# Altium schematic sheet floorctrl.SchDoc
size A
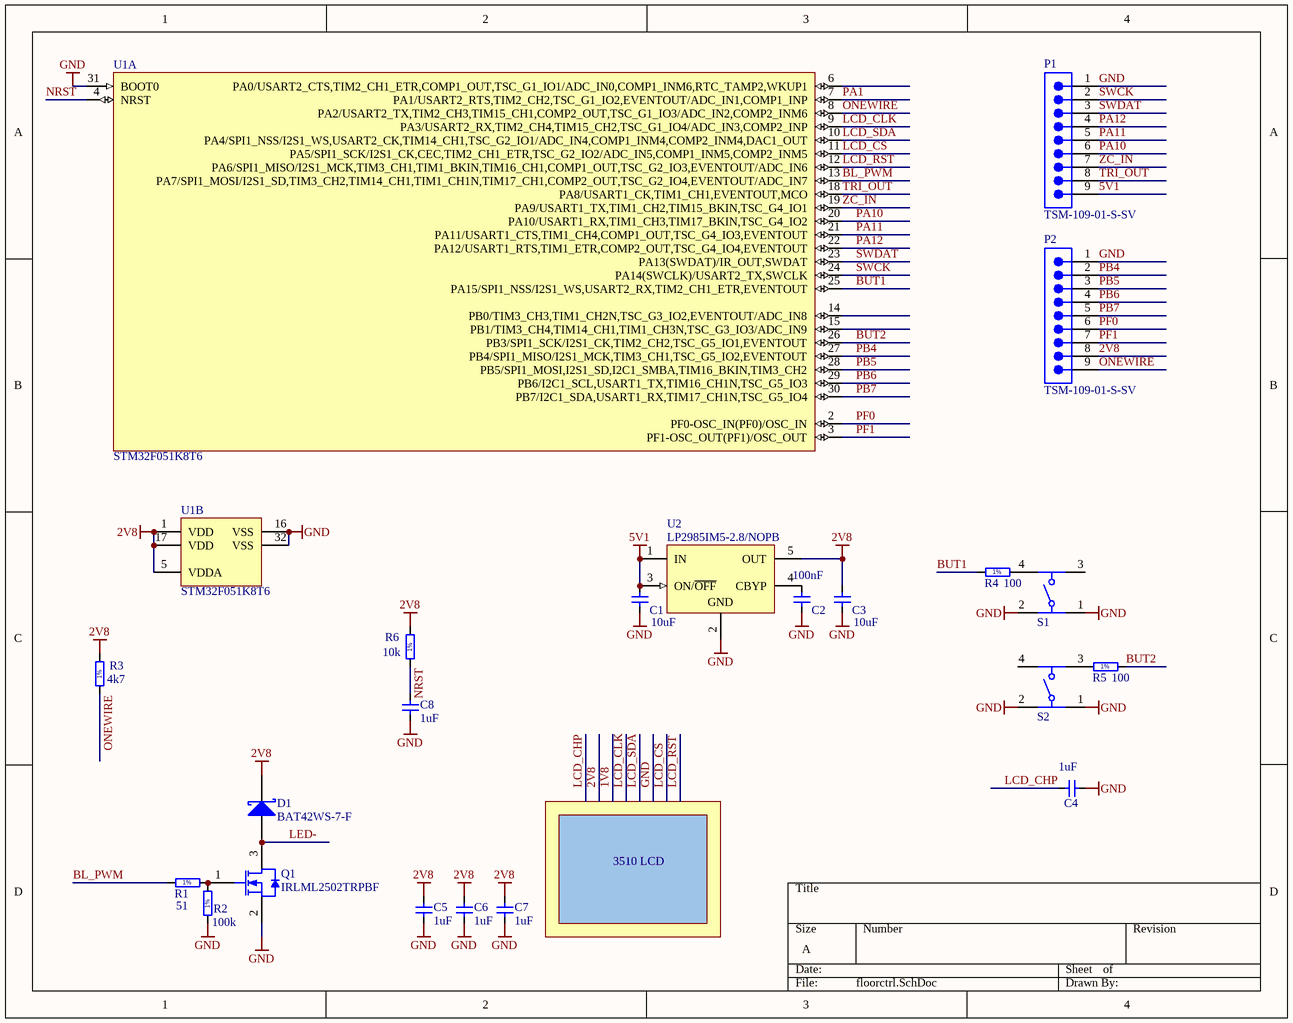
[diagram p0: floorctrl.SchDoc]

## Parts
C1  10uF  [CAP0805R]
C2  100nF  [CAP0805R]
C3  10uF  [CAP0805R]
C4  1uF  [CAP0805R]
C5  1uF  [CAP0805R]
C6  1uF  [CAP0805R]
C7  1uF  [CAP0805R]
C8  1uF  [CAP0805R]
D1  BAT42WS-7-F  [DIOD-SOD323-2_V]
P1  TSM-109-01-S-SV  [SMTC-TSM-109-01-X-SV]
P2  TSM-109-01-S-SV  [SMTC-TSM-109-01-X-SV]
Q1  IRLML2502TRPBF  [INTR-SOT-23-3_V]
R1  51  [RES0805R]
R2  100k  [RES0805R]
R3  4k7  [RES0805R]
R4  100  [RES0805R]
R5  100  [RES0805R]
R6  10k  [RES0805R]
S1  430476073716  [4304x60737x6_12x12x7.3]  (value not drawn)
S2  430476073716  [4304x60737x6_12x12x7.3]  (value not drawn)
U1  STM32F051K8T6  [STM-LQFP32_L]  (parts A,B of 2)
U2  LP2985IM5-2.8/NOPB  [DBV0005A_L]

## Nets
2V8: C3.2 C5.2 C6.2 C7.2 D1.2(K) P2.8 R3.2 R6.2 U1.1(VDD) U1.5(VDDA) U1.17(VDD) U2.5(OUT)
5V1: C1.2 P1.9 U2.1(IN) U2.3(ON/~{OFF})
GND: C1.1 C2.1 C3.1 C4.2 C5.1 C6.1 C7.1 C8.1 P1.1 P2.1 Q1.2(S) R2.1 S1.1 S1.2 S2.1 S2.2 U1.16(VSS) U1.31(BOOT0) U1.32(VSS) U2.2(GND)
BL_PWM: R1.1 U1.13(PA7/SPI1_MOSI/I2S1_SD,TIM3_CH2,TIM14_CH1,TIM1_CH1N,TIM17_CH1,COMP2_OUT,TSC_G2_IO4,EVENTOUT/ADC_IN7)
BUT1: R4.1 U1.25(PA15/SPI1_NSS/I2S1_WS,USART2_RX,TIM2_CH1_ETR,EVENTOUT)
BUT2: R5.2 U1.26(PB3/SPI1_SCK/I2S1_CK,TIM2_CH2,TSC_G5_IO1,EVENTOUT)
LCD_CHP: C4.1
LCD_CLK: U1.9(PA3/USART2_RX,TIM2_CH4,TIM15_CH2,TSC_G1_IO4/ADC_IN3,COMP2_INP)
LCD_CS: U1.11(PA5/SPI1_SCK/I2S1_CK,CEC,TIM2_CH1_ETR,TSC_G2_IO2/ADC_IN5,COMP1_INM5,COMP2_INM5)
LCD_RST: U1.12(PA6/SPI1_MISO/I2S1_MCK,TIM3_CH1,TIM1_BKIN,TIM16_CH1,COMP1_OUT,TSC_G2_IO3,EVENTOUT/ADC_IN6)
LCD_SDA: U1.10(PA4/SPI1_NSS/I2S1_WS,USART2_CK,TIM14_CH1,TSC_G2_IO1/ADC_IN4,COMP1_INM4,COMP2_INM4,DAC1_OUT)
LED-: D1.1(A) Q1.3(D)
NRST: C8.2 R6.1 U1.4(NRST)
ONEWIRE: P2.9 R3.1 U1.8(PA2/USART2_TX,TIM2_CH3,TIM15_CH1,COMP2_OUT,TSC_G1_IO3/ADC_IN2,COMP2_INM6)
PA1: U1.7(PA1/USART2_RTS,TIM2_CH2,TSC_G1_IO2,EVENTOUT/ADC_IN1,COMP1_INP)
PA10: P1.6 U1.20(PA10/USART1_RX,TIM1_CH3,TIM17_BKIN,TSC_G4_IO2)
PA11: P1.5 U1.21(PA11/USART1_CTS,TIM1_CH4,COMP1_OUT,TSC_G4_IO3,EVENTOUT)
PA12: P1.4 U1.22(PA12/USART1_RTS,TIM1_ETR,COMP2_OUT,TSC_G4_IO4,EVENTOUT)
PB4: P2.2 U1.27(PB4/SPI1_MISO/I2S1_MCK,TIM3_CH1,TSC_G5_IO2,EVENTOUT)
PB5: P2.3 U1.28(PB5/SPI1_MOSI,I2S1_SD,I2C1_SMBA,TIM16_BKIN,TIM3_CH2)
PB6: P2.4 U1.29(PB6/I2C1_SCL,USART1_TX,TIM16_CH1N,TSC_G5_IO3)
PB7: P2.5 U1.30(PB7/I2C1_SDA,USART1_RX,TIM17_CH1N,TSC_G5_IO4)
PF0: P2.6 U1.2(PF0-OSC_IN(PF0)/OSC_IN)
PF1: P2.7 U1.3(PF1-OSC_OUT(PF1)/OSC_OUT)
SWCK: P1.2 U1.24(PA14(SWCLK)/USART2_TX,SWCLK)
SWDAT: P1.3 U1.23(PA13(SWDAT)/IR_OUT,SWDAT)
TRI_OUT: P1.8 U1.18(PA8/USART1_CK,TIM1_CH1,EVENTOUT,MCO)
ZC_IN: P1.7 U1.19(PA9/USART1_TX,TIM1_CH2,TIM15_BKIN,TSC_G4_IO1)
NetC2_2: C2.2 U2.4(CBYP)
NetQ1_1: Q1.1(G) R1.2 R2.2
NetR4_2: R4.2 S1.4
NetR5_1: R5.1 S2.3

Not connected (* = marked no-connect by the designer): S1 3; S2 4; U1 6(PA0/USART2_CTS,TIM2_CH1_ETR,COMP1_OUT,TSC_G1_IO1/ADC_IN0,COMP1_INM6,RTC_TAMP2,WKUP1) 14(PB0/TIM3_CH3,TIM1_CH2N,TSC_G3_IO2,EVENTOUT/ADC_IN8) 15(PB1/TIM3_CH4,TIM14_CH1,TIM1_CH3N,TSC_G3_IO3/ADC_IN9)

## Notes on the sheet
- 3510 LCD
- (in symbol R0805_4K7_1%_0.125W_100PPM) 1%
- (in symbol R0805_10K_1%_0.125W_100PPM) 1%
- (in symbol R0805_51R_1%_0.125W_100PPM) 1%
- (in symbol R0805_100K_1%_0.125W_100PPM) 1%
- (in symbol R0805_100R_1%_0.125W_100PPM) 1%

## Library data of the parts
C1 C3 = CC0805_10UF_16V_10%_X5R: Part Description: SMD Multilayer Chip Ceramic Capacitor; Manufacturer: GENERIC; Manufacturer1 Part Number: C0805C106K4PAC; Voltage: 16V; TC: X5R; Tolerance: ±10%; Table: Capacitors SMD; Part Number: CC0805_10UF_16V_10%_X5R; Component Kind: Standard; Component Type: Standard; Pin Count: 2; Value: 10uF; Status: Preferred; Manufacturer Part Number: CC0805_10UF_16V_10%_X5R; Case: 0805; Mounted: Yes; Socket: No; SMD: Yes; Manufacturer1 Example: KEMET; Manufacturer1 ComponentHeight: 1.4mm; HelpURL: \\cern.ch\dfs\Applications\Altium\Datasheets\CC1206_X5R_KEMET.pdf; Author: I. Kuznetsov; CreateDate: 12/3/2007; LatestRevisionDate: 12/3/2007; Manufacturer Part Number 2: CC0805KKX5R7BB106
C2 = CC0805_100NF_50V_10%_X7R: Part Description: SMD Multilayer Chip Ceramic Capacitor; Manufacturer: GENERIC; Manufacturer1 Part Number: B37941K5104K62; Voltage: 50V; TC: X7R; Tolerance: ±10%; Table: Capacitors SMD; Part Number: CC0805_100NF_50V_10%_X7R; Component Kind: Standard; Component Type: Standard; Pin Count: 2; Value: 100nF; Status: Preferred; Manufacturer Part Number: CC0805_100NF_50V_10%_X7R; Case: 0805; Mounted: Yes; Socket: No; SMD: Yes; Manufacturer1 Example: EPCOS; Manufacturer1 ComponentHeight: 1.35mm; HelpURL: \\cern.ch\dfs\Applications\Altium\Datasheets\CC0805_X7R_EPCOS.pdf; Author: I. Kuznetsov; CreateDate: 12/3/2007; LatestRevisionDate: 12/3/2007; Manufacturer Part Number 2: CC0805KPX7R9BB104
C4-C8 = CC0805_1UF_16V_10%_X7R: Part Description: SMD Multilayer Chip Ceramic Capacitor; Manufacturer: GENERIC; Manufacturer1 Part Number: B37941K9105K062; Voltage: 16V; TC: X7R; Tolerance: ±10%; Table: Capacitors SMD; Part Number: CC0805_1UF_16V_10%_X7R; Component Kind: Standard; Component Type: Standard; Pin Count: 2; Value: 1uF; Status: Preferred; Manufacturer Part Number: CC0805_1UF_16V_10%_X7R; Case: 0805; Mounted: Yes; Socket: No; SMD: Yes; Manufacturer1 Example: EPCOS; Manufacturer1 ComponentHeight: 1.3mm; HelpURL: \\cern.ch\dfs\Applications\Altium\Datasheets\CC0805_X7R_EPCOS_HC.pdf; Author: I. Kuznetsov; CreateDate: 12/3/2007; LatestRevisionDate: 12/3/2007; Manufacturer Part Number 2: CC0805KFX7R7BB105
D1 = CMP-2000-05925-1: Schottky Barrier Diode, 30 V, -55 to 125 degC, 2-Pin SOD323, RoHS, Tape and Reel; Manufacturer: DiodesIncorporated; Ir - Reverse Current: 0.5uAat25V; Type: SurfaceMountSchottkyBarrierDiode; If - Forward Current: 0.1A; Pd - Power Dissipation: 200mW; Vf - Forward Voltage: 1Vat0.2A; Unit Weight: 0.000173oz; Ifsm - Forward Surge Current: 4A; trr - Reverse Recovery time: 5ns; Configuration: Single; Vrrm - Repetitive Reverse Voltage: 30V; RoHS: True; Height: 1mm; Length: 1.8mm; Packaging: Reel; Package Reference: SOD323-2; Manufacturer URL: http://www.diodes.com/; Mounting Style: SMD/SMT; Datasheet URL: http://www.diodes.com/_files/datasheets/ds30100.pdf; Package URL: http://www.vishay.com/docs/71192/71192.pdf; Maximum Operating Temperature: +125C; Brand: DiodesIncorporated; Series: BAT42; Technology: Si; Package / Case: SOD-323; Width: 1.4mm; Package Description: 2-Pin Surface Mount Device, Body 1.7 x 1.3 mm; Termination Style: SMD/SMT; Minimum Operating Temperature: -55C; Datasheet Version: Rev. 14-2, 06/2012; Operating Temperature Range: -55Cto+125C; Product: SchottkyDiodes; Mounting Technology: SurfaceMount; Product Category: SchottkyDiodes&Rectifiers; Factory Pack Quantity: 3000
P1 P2 = CMP-1024-00278-1: 0.025" SQ Post Header, Surface Mount, Vertical, -55 to 125 degC, 2.54 mm Pitch, 9-Pin, Male, RoHS; Manufacturer: Samtec; Pitch: 2.54 mm; PackageDescription: Single Row .100 SMT Assembly; ComponentLink1URL: http://www.samtec.com; PackageVersion: BP, 8/2002; ComponentLink1Description: Manufacturer URL; DatasheetVersion: F-214; Temperature Range: -55 to 125 degC; PartNumber: TSM-109-01-S-SV; PackageReference: TSM-109-01-X-SV; RoHS: True; ComponentLink3URL: http://www.samtec.com/documents/webfiles/cpdf/TSM-1XX-XX-XXX-SV-XX-XXX-XX-MKT.pdf; Mounting Technology: Surface Mount; Orientation: Vertical; ComponentLink2URL: http://www.samtec.com/documents/webfiles/pdf/TSM.PDF; ComponentLink3Description: Package Specification; ComponentLink2Description: Datasheet
Q1 = CMP-2000-04985-1: N-Channel HEXFET(R) Power MOSFET, 20 V VDS, +/- 12 V VGS, 4.2 A, 3-Pin SOT23, RoHS, Tape and Reel; Manufacturer: International Rectifier; Drain-to-Source Voltage [Vdss]: 20V; Drain-Source On Resistance-Max: 0.045O; Qg Gate Charge: 8nC; Rated Power Dissipation: 1.25W; Package Reference: SOT-23-3; Manufacturer URL: http://internationalrectifier.com/; Package Description: 3-Pin Small Outline Transistor, Body 2.92 x 1.3 mm, Pitch 0.95 mm; Datasheet Version: Apr-14; Channel Type: N-Channel; Datasheet URL: https://datasheet.ciiva.com/6383/irlml2502pbf-6383216.pdf
R1 = R0805_51R_1%_0.125W_100PPM: Part Description: General Purpose Thick Film Chip Resistor; Manufacturer: GENERIC; Manufacturer1 Part Number: NRC10F51R0TRF; Power: 0.125W; TC: ±100ppm/°C; Tolerance: ±1%; Table: Resistors SMD; Part Number: R0805_51R_1%_0.125W_100PPM; Component Kind: Standard; Component Type: Standard; Footprint: RESC2012X60N; PackageDescription: Standard; Pin Count: 2; Value: 51; Status: Preferred; Manufacturer Part Number: R0805_51R_1%_0.125W_100PPM; Case: 0805; Mounted: Yes; Socket: No; SMD: Yes; Manufacturer1 Example: NIC COMPONENT; Manufacturer1 ComponentHeight: 0.6mm; HelpURL: \\cern.ch\dfs\Applications\Altium\Datasheets\R0805_NIC_NRC.pdf; Author: CERN DEM JLC; CreateDate: 12/3/2007; LatestRevisionDate: 3/13/2008
R2 = R0805_100K_1%_0.125W_100PPM: Part Description: General Purpose Thick Film Chip Resistor; Manufacturer: GENERIC; Manufacturer1 Part Number: NRC10F1003TRF; Power: 0.125W; TC: ±100ppm/°C; Tolerance: ±1%; Table: Resistors SMD; Part Number: R0805_100K_1%_0.125W_100PPM; Component Kind: Standard; Component Type: Standard; Footprint: RESC2012X60N; PackageDescription: Standard; Pin Count: 2; Value: 100k; Status: Preferred; Manufacturer Part Number: R0805_100K_1%_0.125W_100PPM; Case: 0805; Mounted: Yes; Socket: No; SMD: Yes; Manufacturer1 Example: NIC COMPONENT; Manufacturer1 ComponentHeight: 0.6mm; HelpURL: \\cern.ch\dfs\Applications\Altium\Datasheets\R0805_NIC_NRC.pdf; Author: CERN DEM JLC; CreateDate: 12/3/2007; LatestRevisionDate: 3/13/2008
R3 = R0805_4K7_1%_0.125W_100PPM: Part Description: General Purpose Thick Film Chip Resistor; Manufacturer: GENERIC; Manufacturer1 Part Number: NRC10F4701TRF; Power: 0.125W; TC: ±100ppm/°C; Tolerance: ±1%; Table: Resistors SMD; Part Number: R0805_4K7_1%_0.125W_100PPM; Component Kind: Standard; Component Type: Standard; Footprint: RESC2012X60N; PackageDescription: Standard; Pin Count: 2; Value: 4k7; Status: Preferred; Manufacturer Part Number: R0805_4K7_1%_0.125W_100PPM; Case: 0805; Mounted: Yes; Socket: No; SMD: Yes; Manufacturer1 Example: NIC COMPONENT; Manufacturer1 ComponentHeight: 0.6mm; HelpURL: \\cern.ch\dfs\Applications\Altium\Datasheets\R0805_NIC_NRC.pdf; Author: CERN DEM JLC; CreateDate: 12/3/2007; LatestRevisionDate: 3/13/2008
R4 R5 = R0805_100R_1%_0.125W_100PPM: Part Description: General Purpose Thick Film Chip Resistor; Manufacturer: GENERIC; Manufacturer1 Part Number: NRC10F4700TRF; Power: 0.125W; TC: ±100ppm/°C; Tolerance: ±1%; Table: Resistors SMD; Part Number: R0805_100R_1%_0.125W_100PPM; Component Kind: Standard; Component Type: Standard; Footprint: RESC2012X60N; PackageDescription: Standard; Pin Count: 2; Value: 100; Status: Preferred; Manufacturer Part Number: R0805_100R_1%_0.125W_100PPM; Case: 0805; Mounted: Yes; Socket: No; SMD: Yes; Manufacturer1 Example: NIC COMPONENT; Manufacturer1 ComponentHeight: 0.6mm; HelpURL: \\cern.ch\dfs\Applications\Altium\Datasheets\R0805_NIC_NRC.pdf; Author: CERN DEM JLC; CreateDate: 12/3/2007; LatestRevisionDate: 3/13/2008
R6 = R0805_10K_1%_0.125W_100PPM: Part Description: General Purpose Thick Film Chip Resistor; Manufacturer: GENERIC; Manufacturer1 Part Number: NRC10F1002TRF; Power: 0.125W; TC: ±100ppm/°C; Tolerance: ±1%; Table: Resistors SMD; Part Number: R0805_10K_1%_0.125W_100PPM; Component Kind: Standard; Component Type: Standard; Footprint: RESC2012X60N; PackageDescription: Standard; Pin Count: 2; Value: 10k; Status: Preferred; Manufacturer Part Number: R0805_10K_1%_0.125W_100PPM; Case: 0805; Mounted: Yes; Socket: No; SMD: Yes; Manufacturer1 Example: NIC COMPONENT; Manufacturer1 ComponentHeight: 0.6mm; HelpURL: \\cern.ch\dfs\Applications\Altium\Datasheets\R0805_NIC_NRC.pdf; Author: CERN DEM JLC; CreateDate: 12/3/2007; LatestRevisionDate: 3/13/2008
S1 S2 = 430476073716: WS-TATV 12x12mm washable Tact Switch, THT version; Operation Force: 160g; ComponentLink1Description: Manufacturer; ComponentLink1URL: http://www.we-online.de; ComponentLink2Description: Datasheet; ComponentLink2URL: http://katalog.we-online.de/em/datasheet/4304x60737x6.pdf; Part Number: 430476073716; Published Date: June 2017; Publisher: Wurth Elektronik; Size: 12x12x7.3 mm; Life Cycle: 500000 cycles
U1 = CMP-0304-00021-1: ARM Cortex-M0 32-bit MCU, 64 KB Flash, 8 KB Internal RAM, 25 I/Os, 32-pin LQFP, -40 to 85 degC, Tray; I/Os (High Current): 25; Operating Frequency(F) (Processor speed) (MHz): 48; FLASH Size (Prog) (kB): 64; Internal RAM Size (kB): 8; Supply Voltage(Vcc) min (V): 2; ComponentLink2Description: Datasheet; PackageReference: LQFP32; PartNumber: STM32F051K8T6; ComponentLink1URL: http://www.st.com/web/en/home.html; DatasheetVersion: Rev. 3; Mounting Technology: Surface Mount; PackageDescription: 32-Pin Low Profile Quad Flat Package, 7 x 7 mm Body, 0.8 mm Pitch; Packing: Tray; ComponentLink1Description: Manufacturer URL; ComponentLink3Description: Package Specification; PackageVersion: Rev. 1, 07/2013; ComponentLink2URL: http://www.st.com/st-web-ui/static/active/en/resource/technical/document/datasheet/DM00039193.pdf; Core: ARM Cortex-M0; ComponentLink3URL: http://www.st.com/st-web-ui/static/active/en/resource/technical/document/datasheet/DM00088500.pdf
U2 = CMP-0062-01978-3: Micropower 150 mA Low-Noise Ultra Low-Dropout Regulator, 5-pin SOT-23, Pb-Free; Manufacturer: Texas Instruments; PowerWise: N; CompType: LDO IC; PackageTopMarking: L0KB*XTT; RoHS: Y; PackageReference: DBV0005A; ComponentLink1URL: http://www.ti.com/general/docs/lit/getliterature.tsp?genericPartNumber=LP2985-N&fileType=pdf; ComponentLink1Description: Datasheet URL; PinCount: 5; PackageDescription: Molded SOT-23, .115 x .063 x .040 in Body, 5 Lead, .0375 in Pitch